# Altium schematic sheet 飞控主板2.SchDoc
size A4
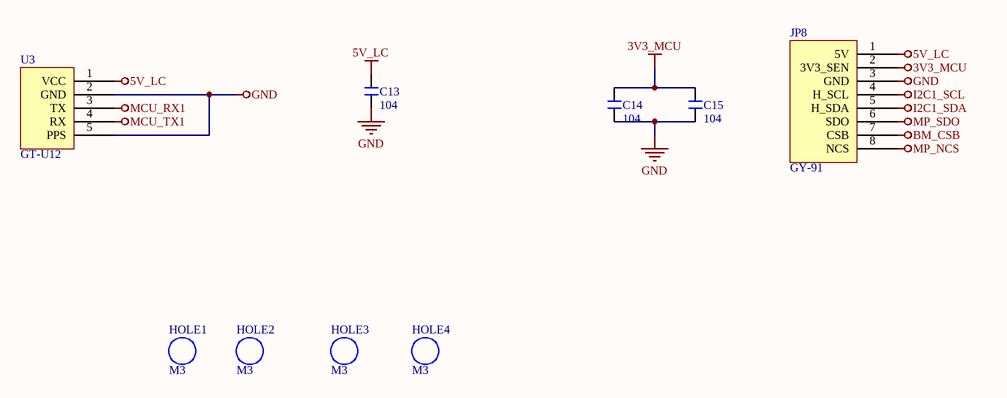
[diagram p0: 飞控主板2.SchDoc]

## Parts
C13  104  [0603C]
C14  104  [0603C]
C15  104  [0603C]
HOLE1  M3  [M3 5.4MM]
HOLE2  M3  [M3 5.4MM]
HOLE3  M3  [M3 5.4MM]
HOLE4  M3  [M3 5.4MM]
JP8  GY-91  [GY-91]
U3  GT-U12  [GT-U12]

## Nets
3V3_MCU: C14.2 C15.2 JP8.2(3V3_SEN)
5V_LC: C13.2 JP8.1(5V) U3.1(VCC)
BM_CSB: JP8.7(CSB)
GND: C13.1 C14.1 C15.1 JP8.3(GND) U3.2(GND) U3.5(PPS)
I2C1_SCL: JP8.4(H_SCL)
I2C1_SDA: JP8.5(H_SDA)
MCU_RX1: U3.3(TX)
MCU_TX1: U3.4(RX)
MP_NCS: JP8.8(NCS)
MP_SDO: JP8.6(SDO)

## Library data of the parts
C13-C15 = C: 无极性贴片电容; 版权归属: 源创客; BOM名称: 无极性贴片电容; 学习资源: www.ooocke.com
HOLE1-HOLE4 = M3: 铜柱孔; 版权归属: 源创客; BOM名称: 铜柱孔; 学习资源: www.ooocke.com
JP8 = GY-91: 优信电子GY-91接口，MPU9250+BMP280
U3 = GT-U12: GPS模块